# Altium schematic sheet HamamatsuSensorBoard.SchDoc
size A
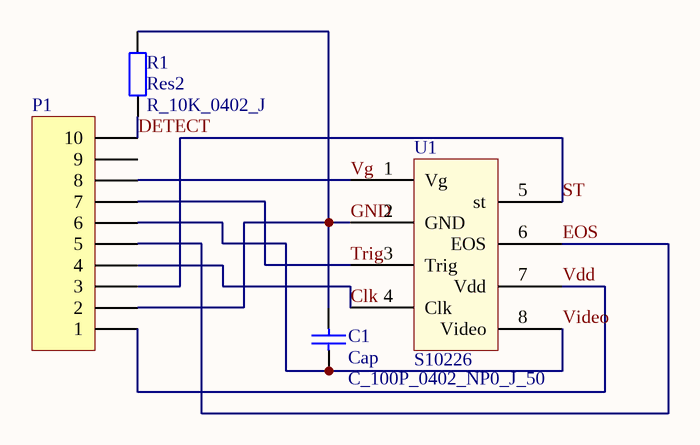
[diagram p0: HamamatsuSensorBoard.SchDoc]

## Parts
C1  Cap  value C_100P_0402_NP0_J_50  [C_0402]
P1  Header 10  [609-4377-ND]  (value not drawn)
R1  Res2  value R_10K_0402_J  [R_0402]
U1  S10226  [S10226]

## Nets
Clk: P1.4 U1.4(Clk)
DETECT: P1.10 R1.1
EOS: P1.5 U1.6(EOS)
GND: C1.2(GND) P1.2 R1.2 U1.2(GND)
ST: P1.3 U1.5(st)
Trig: P1.7 U1.3(Trig)
Vdd: P1.1 U1.7(Vdd)
Vg: P1.8 U1.1(Vg)
Video: C1.1(Vdd) P1.6 U1.8(Video)

Not connected (* = marked no-connect by the designer): P1 9

## Library data of the parts
C1 = Cap: Capacitor; Published: 8-Jun-2000; LatestRevisionDate: 17-Jul-2002; LatestRevisionNote: Re-released for DXP Platform.; PackageReference: RAD-0.3; Publisher: Altium Limited; PackageDescription: Radial Cap, Thru-Hole; 2 Leads; 0.3 in Pin Spacing; Supplier 1: Digi-Key; Supplier Part Number 1: 490-3458-6-ND
P1 = Header 10: Header, 10-Pin; LatestRevisionDate: 17-Jul-2002; LatestRevisionNote: Re-released for DXP Platform.; Publisher: Altium Limited; Supplier 1: Digi-Key; Supplier Part Number 1: 609-4377-ND; Supplier 2: Mouser; Supplier Part Number 2: 649-10112690G0305ULF
R1 = Res2: Resistor; Published: 8-Jun-2000; LatestRevisionDate: 17-Jul-2002; LatestRevisionNote: Re-released for DXP Platform.; Publisher: Altium Limited; Supplier 1: Digi-Key; Supplier Part Number 1: P10KJCT-ND; Supplier 2: Mouser; Supplier Part Number 2: 667-ERJ-2GEJ103X
U1 = S10226: Hamamatsu 1024 CMOS image sensor